# Altium schematic sheet 03_Mode_Inputs.SchDoc
size A; SheetNumber: 3; SheetTotal: 6
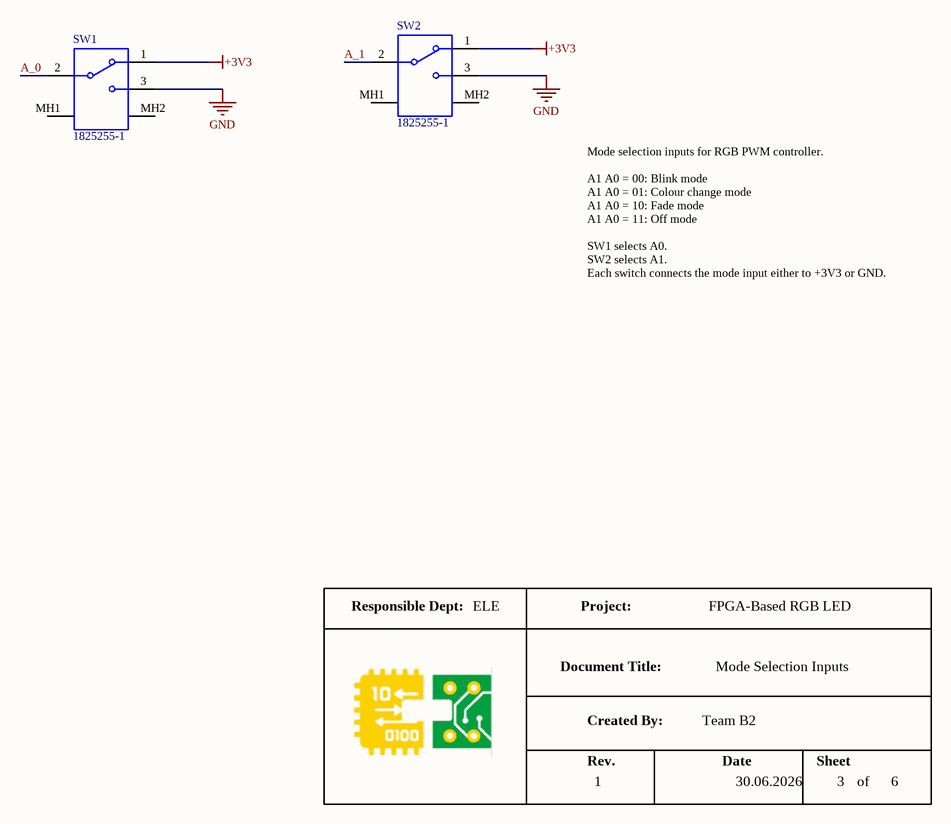
[diagram p0: 03_Mode_Inputs.SchDoc]

## Parts
SW1  1825255-1  [TECO-1825255-1_V]
SW2  1825255-1  [TECO-1825255-1_V]

## Nets
+3V3: SW1.1 SW2.1
GND: SW1.3 SW2.3
A_0: SW1.2
A_1: SW2.2

Not connected (* = marked no-connect by the designer): SW1 MH1 MH2; SW2 MH1 MH2

## Notes on the sheet
- Mode selection inputs for RGB PWM controller.
  A1 A0 = 00: Blink mode
  A1 A0 = 01: Colour change mode
  A1 A0 = 10: Fade mode
  A1 A0 = 11: Off mode
  SW1 selects A0.
  SW2 selects A1.
  Each switch connects the mode input either to +3V3 or GND.
- Responsible Dept:
- ELE
- Project:
- FPGA-Based RGB LED
- Document Title:
- Created By:
- Team B2
- Mode Selection Inputs
- Rev.
- 1
- Date
- 30.06.2026
- Sheet
- 3
- of
- 6

## Library data of the parts
SW1 SW2 = CMP-011-00001-2: Slide Switch, SPDT, 0.3A, 125 V, -20 to 85 degC, 5-Pin THD, RoHS, Tray; Manufacturer: TE Connectivity; Current Rating: 300mA; Voltage Rating (AC): 125V; Max Contact Resistance: 30mohm; Operating Force: 600gf; Manufacturer URL: http://www.te.com/; Max Current Rating: 300mA; Contact Plating: Silver; Contact Material: Copper; Datasheet URL: http://www.te.com/commerce/DocumentDelivery/DDEController?Action=showdoc&DocId=Customer+Drawing%7F1825255%7FA4%7Fpdf%7FEnglish%7FENG_CD_1825255_A4_baseFilename.pdf%7F1825255-1; Throw Configuration: SPDT; Packaging: Bulk; Package Quantity: 560; Max Voltage Rating (AC): 125V; Mounting Technology: TH; RoHS Compliant: True; Case/Package: 1825255-1; Datasheet Version: Rev. A4, 03/2014; Contact Finish: Silver; Package Reference: 1825255-1; Package Description: 5-Pin Through Hole Device, Body 6.7 x 16 mm, Pitch 4 mm; Min Operating Temperature: -20°C; Max Operating Temperature: 85°C